# Altium schematic sheet SH5 - LED.SchDoc
size B
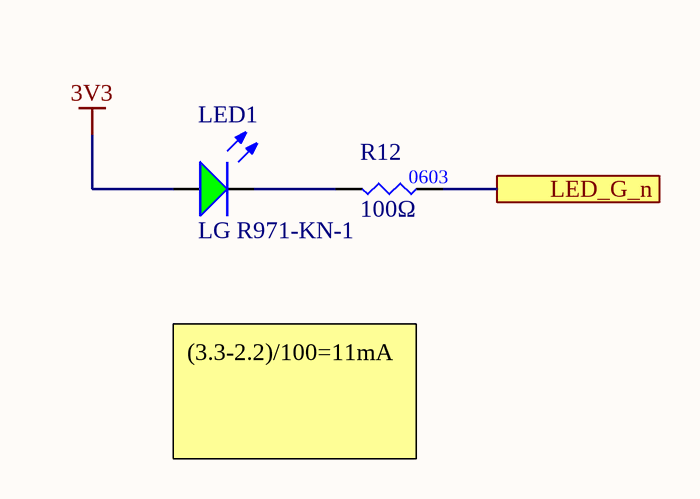
[diagram p0: SH5 - LED.SchDoc]

## Parts
LED1  Manufacturer Part Number 1: LG R971-KN-1  [LED_0805_GREEN]  (hidden comment: LED_GREEN)
R12  value 100Ω  [RES0603]  (hidden comment: RES_100Ω_0603_1%)

## Ports
LED_G_n

## Nets
3V3: LED1.1(A)
LED_G_n: R12.2 ; port LED_G_n
NetLED1_2: LED1.2(K) R12.1

## Notes on the sheet
- (3.3-2.2)/100=11mA
- (in symbol RES_100Ω_0603_1%) 0603

## Library data of the parts
LED1 = LED_GREEN: LED GREEN DIFFUSED 0805 SMD; Manufacturer 1: OSRAM; Forward Voltage Drop: 2.2V; Package/Footprint: 0805; Supplier Part Number 1: 475-1410-1-ND; Supplier 1: Digi-Key; Mounting Type: SMD
R12 = RES_100Ω_0603_1%: RES 100 OHM 1% 1/10W 0603; Manufacturer 1: Yageo; Manufacturer Part Number 1: RC0603FR-07100RL; Supplier Part Number 1: 311-100HRCT-ND; Supplier 1: Digi-Key